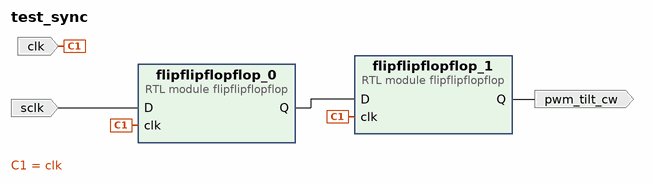
[diagram p0: block diagram of the top level]
# Vivado block design test_sync, xc7z020clg400-1, Vivado 2023.2
create_bd_design test_sync

create_bd_port -dir I sclk
create_bd_port -dir O pwm_tilt_cw
create_bd_port -dir I -type clk clk

create_bd_cell -type module -reference flipflipflopflop flipflipflopflop_0
create_bd_cell -type module -reference flipflipflopflop flipflipflopflop_1

# ---- connections ----

connect_bd_net [get_bd_ports clk] [get_bd_pins flipflipflopflop_0/clk] [get_bd_pins flipflipflopflop_1/clk]
connect_bd_net [get_bd_pins flipflipflopflop_0/Q] [get_bd_pins flipflipflopflop_1/D]
connect_bd_net [get_bd_pins flipflipflopflop_1/Q] [get_bd_ports pwm_tilt_cw]
connect_bd_net [get_bd_ports sclk] [get_bd_pins flipflipflopflop_0/D]

validate_bd_design
save_bd_design
